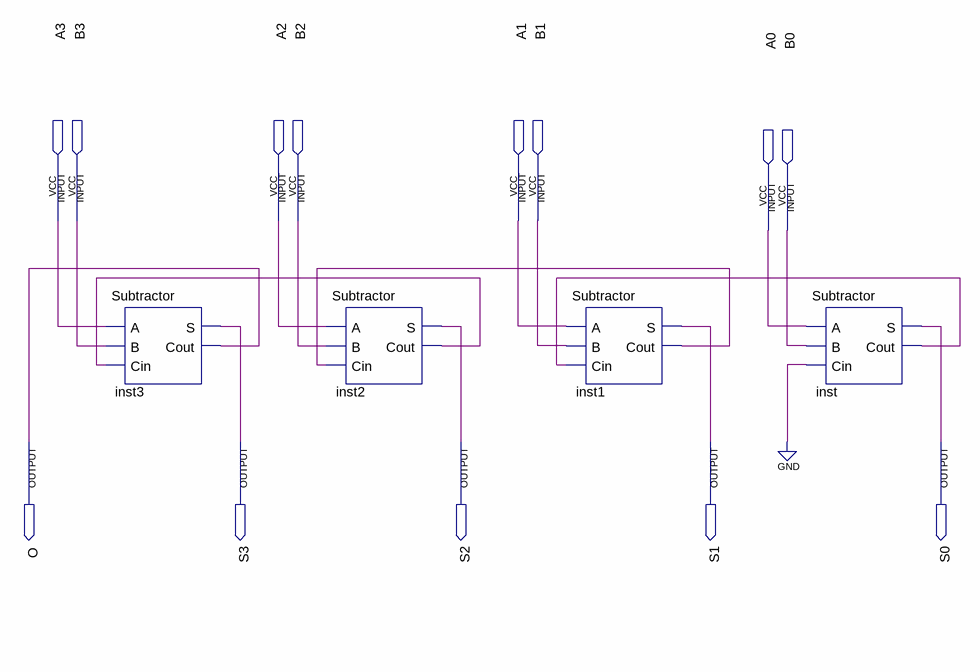
[diagram p0: schematic sheet]
// Quartus schematic Subtractor_4_bits.bdf as structural Verilog: 4 symbols, 13 pins
module Subtractor_4_bits (
  input  A3,
  input  B3,
  input  A2,
  input  B2,
  input  A1,
  input  B1,
  input  A0,
  input  B0,
  output O,
  output S3,
  output S2,
  output S1,
  output S0
);

  wire inst1_cout, inst2_cout, inst_cout;

  Subtractor inst3 (.A(A3), .B(B3), .Cin(inst2_cout), .S(S3), .Cout(O));
  Subtractor inst2 (.A(A2), .B(B2), .Cin(inst1_cout), .S(S2), .Cout(inst2_cout));
  Subtractor inst1 (.A(A1), .B(B1), .Cin(inst_cout), .S(S1), .Cout(inst1_cout));
  Subtractor inst (.A(A0), .B(B0), .Cin(1'b0), .S(S0), .Cout(inst_cout));
endmodule
